# Altium schematic sheet CE842170047_SHEET2.SchDoc
size Tabloid; SheetNumber: 2; SheetTotal: 5; PageSetup: Record=PageOptions|CenterHorizontal=True|CenterVertical=True|PrintScale=0.70|XCorrection=1.00|YCorrection=1.00|PrintKind=1|BorderSize=5000000|LeftOffset=0|BottomOffset=0|Orientation=2|PaperLength=1000|PaperWidth=1000|Scale=100|PaperSource=7|PrintQuality=-4|MediaType=1|DitherType=10|PaperKind=8 1/2x11|PrintScaleMode=1; SPICEModelCacheMIYJXAQF: <root> / <DocumentId>MIYJXAQF</DocumentId> / </root>
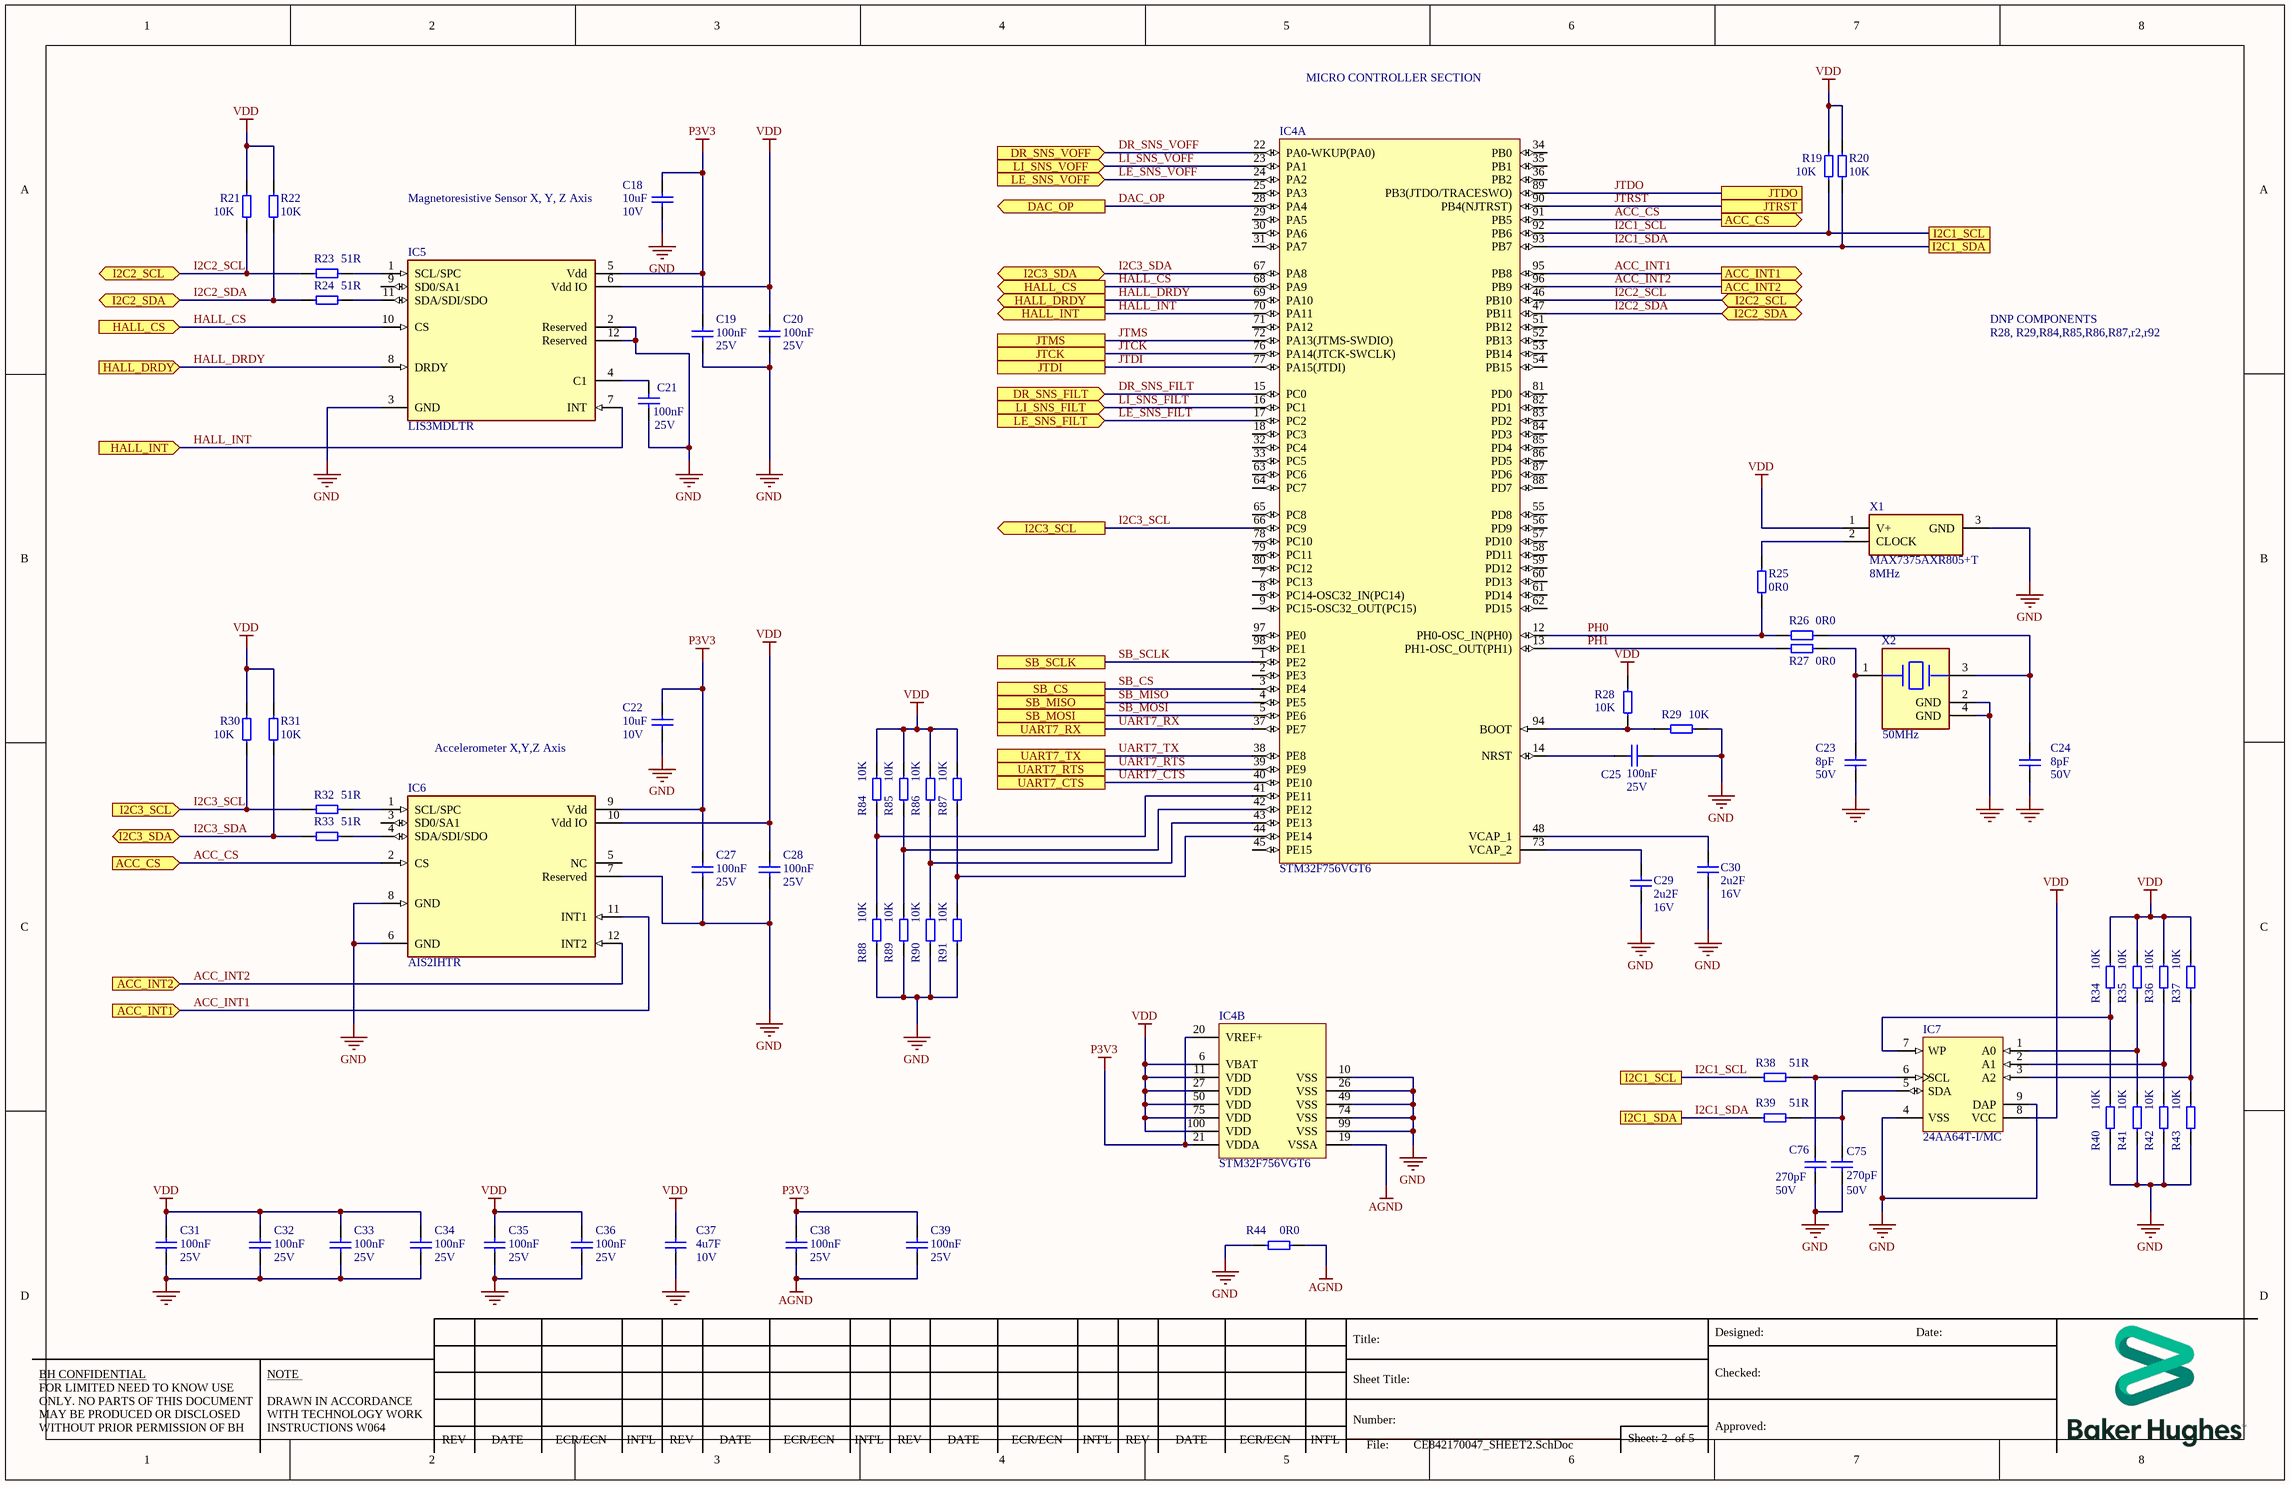
[diagram p0: CE842170047_SHEET2.SchDoc]

## Parts
C18  value 10uF  Voltage: 10V  [C0603]  (hidden comment: KK/96159/3701)
C19  value 100nF  Voltage: 25V  [C0603]  (hidden comment: KK/96159/4501)
C20  value 100nF  Voltage: 25V  [C0603]  (hidden comment: KK/96159/4501)
C21  value 100nF  Voltage: 25V  [C0603]  (hidden comment: KK/96159/4501)
C22  value 10uF  Voltage: 10V  [C0603]  (hidden comment: KK/96159/3701)
C23  value 8pF  Voltage: 50V  [C0603]  (hidden comment: KK/96159/0088)
C24  value 8pF  Voltage: 50V  [C0603]  (hidden comment: KK/96159/0088)
C25  value 100nF  Voltage: 25V  [C0603]  (hidden comment: KK/96159/4501)
C27  value 100nF  Voltage: 25V  [C0603]  (hidden comment: KK/96159/4501)
C28  value 100nF  Voltage: 25V  [C0603]  (hidden comment: KK/96159/4501)
C29  value 2u2F  Voltage: 16V  [C0603]  (hidden comment: KK/96159/3634)
C30  value 2u2F  Voltage: 16V  [C0603]  (hidden comment: KK/96159/3634)
C31  value 100nF  Voltage: 25V  [C0603]  (hidden comment: KK/96159/4501)
C32  value 100nF  Voltage: 25V  [C0603]  (hidden comment: KK/96159/4501)
C33  value 100nF  Voltage: 25V  [C0603]  (hidden comment: KK/96159/4501)
C34  value 100nF  Voltage: 25V  [C0603]  (hidden comment: KK/96159/4501)
C35  value 100nF  Voltage: 25V  [C0603]  (hidden comment: KK/96159/4501)
C36  value 100nF  Voltage: 25V  [C0603]  (hidden comment: KK/96159/4501)
C37  value 4u7F  Voltage: 10V  [C0603]  (hidden comment: KK/96159/2666)
C38  value 100nF  Voltage: 25V  [C0603]  (hidden comment: KK/96159/4501)
C39  value 100nF  Voltage: 25V  [C0603]  (hidden comment: KK/96159/4501)
C75  value 270pF  Voltage: 50V  [C0603]  (hidden comment: KK/96159/0243)
C76  value 270pF  Voltage: 50V  [C0603]  (hidden comment: KK/96159/0243)
IC4  MF_PartNumber: STM32F756VGT6  [LQFP-100]  (hidden comment: KK/95414/0147)  (parts A,B of 2)
IC5  MF_PartNumber: LIS3MDLTR  [LGA-12]  (hidden comment: KK/95312/0195)
IC6  MF_PartNumber: AIS2IHTR  [LGA-12]  (hidden comment: KK/95312/0196)
IC7  MF_PartNumber: 24AA64T-I/MC  [DFN-8]  (hidden comment: KK/95413/0138)
R19  value 10K  [R0603]  (hidden comment: KK/96059/0601)
R20  value 10K  [R0603]  (hidden comment: KK/96059/0601)
R21  value 10K  [R0603]  (hidden comment: KK/96059/0601)
R22  value 10K  [R0603]  (hidden comment: KK/96059/0601)
R23  value 51R  [R0603]  (hidden comment: KK/96059/1369)
R24  value 51R  [R0603]  (hidden comment: KK/96059/1369)
R25  value 0R0  [R0603]  (hidden comment: KK/96059/0000)
R26  value 0R0  [R0603]  (hidden comment: KK/96059/0000)
R27  value 0R0  [R0603]  (hidden comment: KK/96059/0000)
R28  value 10K  [R0603]  (hidden comment: KK/96059/0601)
R29  value 10K  [R0603]  (hidden comment: KK/96059/0601)
R30  value 10K  [R0603]  (hidden comment: KK/96059/0601)
R31  value 10K  [R0603]  (hidden comment: KK/96059/0601)
R32  value 51R  [R0603]  (hidden comment: KK/96059/1369)
R33  value 51R  [R0603]  (hidden comment: KK/96059/1369)
R34  value 10K  [R0603]  (hidden comment: KK/96059/0601)
R35  value 10K  [R0603]  (hidden comment: KK/96059/0601)
R36  value 10K  [R0603]  (hidden comment: KK/96059/0601)
R37  value 10K  [R0603]  (hidden comment: KK/96059/0601)
R38  value 51R  [R0603]  (hidden comment: KK/96059/1369)
R39  value 51R  [R0603]  (hidden comment: KK/96059/1369)
R40  value 10K  [R0603]  (hidden comment: KK/96059/0601)
R41  value 10K  [R0603]  (hidden comment: KK/96059/0601)
R42  value 10K  [R0603]  (hidden comment: KK/96059/0601)
R43  value 10K  [R0603]  (hidden comment: KK/96059/0601)
R44  value 0R0  [R0603]  (hidden comment: KK/96059/0000)
R84  value 10K  [R0603]  (hidden comment: KK/96059/0601)
R85  value 10K  [R0603]  (hidden comment: KK/96059/0601)
R86  value 10K  [R0603]  (hidden comment: KK/96059/0601)
R87  value 10K  [R0603]  (hidden comment: KK/96059/0601)
R88  value 10K  [R0603]  (hidden comment: KK/96059/0601)
R89  value 10K  [R0603]  (hidden comment: KK/96059/0601)
R90  value 10K  [R0603]  (hidden comment: KK/96059/0601)
R91  value 10K  [R0603]  (hidden comment: KK/96059/0601)
X1  value 8MHz  MF_PartNumber: MAX7375AXR805+T  [SC70-3]  (hidden comment: OSCILLATOR_3PIN)
X2  value 50MHz  [SMD_1.6X1.2]  (hidden comment: KK/95710/0071)

## Ports
ACC_CS (in), ACC_CS (out), ACC_INT1 (in), ACC_INT1 (out), ACC_INT2 (in), ACC_INT2 (out), DAC_OP (out), DR_SNS_FILT (in), DR_SNS_VOFF (in), HALL_CS (in), HALL_CS (out), HALL_DRDY (in), HALL_DRDY (out), HALL_INT (in), HALL_INT (out), I2C1_SCL, I2C1_SDA, I2C2_SCL (bidir), I2C2_SDA (bidir), I2C3_SCL (in), I2C3_SCL (out), I2C3_SDA (bidir), JTCK, JTDI, JTDO, JTMS, JTRST, LE_SNS_FILT (in), LE_SNS_VOFF (in), LI_SNS_FILT (in), LI_SNS_VOFF (in), SB_CS, SB_MISO, SB_MOSI, SB_SCLK, UART7_CTS, UART7_RTS, UART7_RX, UART7_TX

## Nets
AGND: C38.2 C39.2 IC4.19(VSSA) R44.2
GND: C18.2 C19.2 C20.2 C21.2 C22.2 C23.2 C24.1 C25.2 C27.2 C28.2 C29.2 C30.2 C31.2 C32.2 C33.2 C34.2 C35.2 C36.2 C37.2 C75.2 C76.2 IC4.10(VSS) IC4.26(VSS) IC4.49(VSS) IC4.74(VSS) IC4.99(VSS) IC5.2(Reserved) IC5.3(GND) IC5.12(Reserved) IC6.6(GND) IC6.7(Reserved) IC6.8(GND) IC7.4(VSS) IC7.9(DAP) R29.1 R40.2 R41.2 R42.2 R43.2 R44.1 R88.2 R89.2 R90.2 R91.2 X1.3(GND) X2.2(GND) X2.4(GND)
P3V3: C18.1 C19.1 C22.1 C27.1 C38.1 C39.1 IC4.20(VREF+) IC4.21(VDDA) IC5.5(Vdd) IC6.9(Vdd)
VDD: C20.1 C28.1 C31.1 C32.1 C33.1 C34.1 C35.1 C36.1 C37.1 IC4.6(VBAT) IC4.11(VDD) IC4.27(VDD) IC4.50(VDD) IC4.75(VDD) IC4.100(VDD) IC5.6(Vdd_IO) IC6.10(Vdd_IO) IC7.8(VCC) R19.2 R20.2 R21.2 R22.2 R28.2 R30.2 R31.2 R34.1 R35.1 R36.1 R37.1 R84.1 R85.1 R86.1 R87.1 X1.1(V+)
ACC_CS: IC4.91(PB5) IC6.2(CS) ; port ACC_CS
ACC_INT1: IC4.95(PB8) IC6.11(INT1) ; port ACC_INT1
ACC_INT2: IC4.96(PB9) IC6.12(INT2) ; port ACC_INT2
DAC_OP: IC4.28(PA4) ; port DAC_OP
DR_SNS_FILT: IC4.15(PC0) ; port DR_SNS_FILT
DR_SNS_VOFF: IC4.22(PA0-WKUP(PA0)) ; port DR_SNS_VOFF
HALL_CS: IC4.68(PA9) IC5.10(CS) ; port HALL_CS
HALL_DRDY: IC4.69(PA10) IC5.8(DRDY) ; port HALL_DRDY
HALL_INT: IC4.70(PA11) IC5.7(INT) ; port HALL_INT
I2C1_SCL: IC4.92(PB6) R19.1 R38.1 ; port I2C1_SCL
I2C1_SDA: IC4.93(PB7) R20.1 R39.1 ; port I2C1_SDA
I2C2_SCL: IC4.46(PB10) R21.1 R23.1 ; port I2C2_SCL
I2C2_SDA: IC4.47(PB11) R22.1 R24.1 ; port I2C2_SDA
I2C3_SCL: IC4.66(PC9) R30.1 R32.1 ; port I2C3_SCL
I2C3_SDA: IC4.67(PA8) R31.1 R33.1 ; port I2C3_SDA
JTCK: IC4.76(PA14(JTCK-SWCLK)) ; port JTCK
JTDI: IC4.77(PA15(JTDI)) ; port JTDI
JTDO: IC4.89(PB3(JTDO/TRACESWO)) ; port JTDO
JTMS: IC4.72(PA13(JTMS-SWDIO)) ; port JTMS
JTRST: IC4.90(PB4(NJTRST)) ; port JTRST
LE_SNS_FILT: IC4.17(PC2) ; port LE_SNS_FILT
LE_SNS_VOFF: IC4.24(PA2) ; port LE_SNS_VOFF
LI_SNS_FILT: IC4.16(PC1) ; port LI_SNS_FILT
LI_SNS_VOFF: IC4.23(PA1) ; port LI_SNS_VOFF
PH0: IC4.12(PH0-OSC_IN(PH0)) R25.2 R26.1
PH1: IC4.13(PH1-OSC_OUT(PH1)) R27.1
SB_CS: IC4.3(PE4) ; port SB_CS
SB_MISO: IC4.4(PE5) ; port SB_MISO
SB_MOSI: IC4.5(PE6) ; port SB_MOSI
SB_SCLK: IC4.1(PE2) ; port SB_SCLK
UART7_CTS: IC4.40(PE10) ; port UART7_CTS
UART7_RTS: IC4.39(PE9) ; port UART7_RTS
UART7_RX: IC4.37(PE7) ; port UART7_RX
UART7_TX: IC4.38(PE8) ; port UART7_TX
NetC21_1: C21.1 IC5.4(C1)
NetC23_1: C23.1 R27.2 X2.1(1_Xtal)
NetC24_2: C24.2 R26.2 X2.3(2_Xtal)
NetC25_1: C25.1 IC4.14(NRST)
NetC29_1: C29.1 IC4.73(VCAP_2)
NetC30_1: C30.1 IC4.48(VCAP_1)
NetC75_1: C75.1 IC7.5(SDA) R39.2
NetC76_1: C76.1 IC7.6(SCL) R38.2
NetIC4_41: IC4.41(PE11) R84.2 R88.1
NetIC4_42: IC4.42(PE12) R85.2 R89.1
NetIC4_43: IC4.43(PE13) R86.2 R90.1
NetIC4_44: IC4.44(PE14) R87.2 R91.1
NetIC4_94: IC4.94(BOOT) R28.1 R29.2
NetIC5_1: IC5.1(SCL/SPC) R23.2
NetIC5_11: IC5.11(SDA/SDI/SDO) R24.2
NetIC6_1: IC6.1(SCL/SPC) R32.2
NetIC6_4: IC6.4(SDA/SDI/SDO) R33.2
NetIC7_1: IC7.1(A0) R35.2 R41.1
NetIC7_2: IC7.2(A1) R36.2 R42.1
NetIC7_3: IC7.3(A2) R37.2 R43.1
NetIC7_7: IC7.7(WP) R34.2 R40.1
NetR25_1: R25.1 X1.2(CLOCK)

Not connected (* = marked no-connect by the designer): IC4 2(PE3) 7(PC13) 8(PC14-OSC32_IN(PC14)) 9(PC15-OSC32_OUT(PC15)) 18(PC3) 25(PA3) 29(PA5) 30(PA6) 31(PA7) 32(PC4) 33(PC5) 34(PB0) 35(PB1) 36(PB2) 45(PE15) 51(PB12) 52(PB13) 53(PB14) 54(PB15) 55(PD8) 56(PD9) 57(PD10) 58(PD11) 59(PD12) 60(PD13) 61(PD14) 62(PD15) 63(PC6) 64(PC7) 65(PC8) 71(PA12) 78(PC10) 79(PC11) 80(PC12) 81(PD0) 82(PD1) 83(PD2) 84(PD3) 85(PD4) 86(PD5) 87(PD6) 88(PD7) 97(PE0) 98(PE1); IC5 9(SD0/SA1); IC6 3(SD0/SA1) 5(NC)

## Notes on the sheet
- MICRO CONTROLLER SECTION
- (near C18) Magnetoresistive Sensor X, Y, Z Axis
- DNP COMPONENTS
- R28, R29,R84,R85,R86,R87,r2,r92
- Accelerometer X,Y,Z Axis
- BH CONFIDENTIAL
- NOTE
- Title:
- Sheet Title:
- Designed:
- Checked:
- Date:
- DRAWN IN ACCORDANCE WITH TECHNOLOGY WORK INSTRUCTIONS W064
- REV
- DATE
- ECR/ECN
- INT'L
- Number:
- Approved:
- FOR LIMITED NEED TO KNOW USE ONLY. NO PARTS OF THIS DOCUMENT MAY BE PRODUCED OR DISCLOSED WITHOUT PRIOR PERMISSION OF BH
- File:
- Sheet:
- of

## Library data of the parts
C18 C22 = KK/96159/3701: CAPACITOR_10uF_10%_10V_0603; ID: 175; Tolerance: 10%; PII_PartNumber: KK/96159/3701; Pins: 2
C19-C21 C25 C27 C28 C31-C36 C38 C39 = KK/96159/4501: CAPACITOR_100nF_+10%_25V_603; ID: 185; Tolerance: 10%; PII_PartNumber: KK/96159/4501; Pins: 2
C23 C24 = KK/96159/0088: CAPACITOR CERAMIC 0603 50V 5% NPO 8pF; ID: 570; PII_PartNumber: KK/96159/0088; Pins: 2; Tolerance: 5%
C29 C30 = KK/96159/3634: CAPACITOR CERAMIC 0603 16V 10% X5R 2u2; ID: 569; PII_PartNumber: KK/96159/3634; Pins: 2; Tolerance: 10%
C37 = KK/96159/2666: CAPACITOR_4u7F_10%_10V_0603; ID: 165; Tolerance: 10%; PII_PartNumber: KK/96159/2666; Pins: 2
C75 C76 = KK/96159/0243: CAPACITOR CER 0603 270pF 10% 50V X5R; ID: 577; PII_PartNumber: KK/96159/0243; Pins: 2; Tolerance: 10%
IC4 = KK/95414/0147: MICROCONTROLLER MCU; Manufacturer: STMICROELECTRONICS; Manufacturer Part Number: STM32F756VGT6U; D/A Converter: 2; I/Os (High Current): 82; Core: ARM Cortex-M7; Packing: Tray; Supply Voltage(Vcc) min (V): 1.7; Operating Frequency(F) (Processor speed) (MHz): 216; Internal RAM Size (kB): 320; FLASH Size (Prog) (kB): 1024; ID: 81; Value: 1MB/32BIT; Voltage: 1.7-3.6V; ComponentLink2Description: Datasheet; DatasheetVersion: Rev. 4; ComponentLink1URL: http://www.st.com/; Package Description: 100-Pin Low Profile Quad Flat Package, Body 14 x 14 mm, Pitch 0.5 mm; ComponentLink1Description: Manufacturer URL; Mounting Technology: Surface Mount; ComponentLink2URL: http://www.st.com/st-web-ui/static/active/en/resource/technical/document/datasheet/DM00166114.pdf; Package Reference: LQFP100; Manufacturer Part Number: STM32F756VGT6; Manufacturer: STMicroelectronics; PII_PartNumber: KK/95414/0147; Pins: 100; Temperature: -40 to +85C
IC5 = KK/95312/0195: 3 AXIS MAGNETIC SENSOR; Manufacturer: STMicroelectronics; Sensor Output: I2C,SPI; Operating Supply Current: 40-270uA; Max Supply Voltage: 3.6V; Min Supply Voltage: 1.71V; ID: 103; Voltage: 1.9 - 3.6V; ComponentLink2URL: https://www.st.com/resource/en/datasheet/lis3mdl.pdf; Category: IC; Manufacturer Part Number: LIS3MDLTR; Octopart: https://octopart.com/lis3mdltr-stmicroelectronics-29403125; Automotive: No; Sensing Method: Magnetic; ComponentLink2Description: Datasheet; RoHS: TRUE; Device Class L3: unset; Device Class L1: Sensors; Temperature: -40 to +85C; Height: 1mm; Mouser Description: Board Mount Hall Effect / Magnetic Sensors Ultra Lo-Pwr Hi Perf 3-Axis 1.9-3.6V; Temperature Range High: +85°C; Lead Free: Yes; Device Class L2: Magnetic Sensors; Footprint Url: https://www.st.com/content/ccc/resource/technical/document/technical_note/73/17/9c/16/dd/96/4a/01/CD00134799.pdf/files/CD00134799.pdf/jcr:content/translations/en.CD00134799.pdf; Temperature Range Low: -40°C; Package: VFLGA-12-8365767; Digikey Description: SENSOR MR I2C/SPI 12LGA; PII_PartNumber: KK/95312/0195; Pins: 12
IC6 = KK/95312/0196: 3 AXIS DIGITAL ACCELEROMETER 14BIT; Manufacturer: STMicroelectronics; Sensor Output: I2C,SPI; Operating Supply Current: 0.67-110uA; Max Supply Voltage: 3.6V; Sensing Method: X,Y,Z; Min Supply Voltage: 1.62V; ID: 102; Voltage: 1.62 - 3.6V; ComponentLink2URL: https://www.st.com/resource/en/datasheet/lis3mdl.pdf; Category: IC; Octopart: https://www.mouser.co.uk/datasheet/2/389/dm00462829-2042226.pdf; Automotive: YES; ComponentLink2Description: Datasheet; RoHS: TRUE; Device Class L3: unset; Device Class L1: Sensors; Temperature: -40 to +115C; Height: 1mm; Mouser Description: Board Mount Hall Effect / Magnetic Sensors Ultra Lo-Pwr Hi Perf 3-Axis 1.9-3.6V; Temperature Range High: +85°C; Lead Free: Yes; Device Class L2: Magnetic Sensors; Footprint Url: https://www.st.com/content/ccc/resource/technical/document/technical_note/73/17/9c/16/dd/96/4a/01/CD00134799.pdf/files/CD00134799.pdf/jcr:content/translations/en.CD00134799.pdf; Temperature Range Low: -40°C; Package: VFLGA-12-8365767; Digikey Description: SENSOR MR I2C/SPI 12LGA; PII_PartNumber: KK/95312/0196; Pins: 12
IC7 = KK/95413/0138: 64K I2C SERIAL EEPROM; Manufacturer: MICROCHIP; ID: 43; DatasheetVersion: revQ, Jun-2009; PackageReference: DFN-MC8; PackageDescription: 8-Lead Plastic Dual Flat, No Lead Package (MC) - 2x3x0.9mm Body [DFN]; PackageVersion: revBB, Aug-2009; Manufacturer Part Number: 24AA64T-I/MC; PII_PartNumber: KK/95413/0138; Pins: 9; Temperature: -40 +85C
R19-R22 R28-R31 R34-R37 R40-R43 R84-R91 = KK/96059/0601: RESISTOR_10K_1%_0603J_63mW; ID: 1090; Tolerance: 1%; Power: 63mW; PII_PartNumber: KK/96059/0601; Pins: 2
R23 R24 R32 R33 R38 R39 = KK/96059/1369: RESISTOR_51R_1%_0603J_63mW; ID: 1148; Tolerance: 1%; Power: 63mW; Temp_Coeff: 100ppm; PII_PartNumber: KK/96059/1369; Pins: 2
R25-R27 R44 = KK/96059/0000: ZERO OHM LINK; ID: 7; Power: 63mW; PII_PartNumber: KK/96059/0000; Pins: 2
X1 = KK/95710/0303: OSCILLATOR,SMD,CMOS,MAXIM,MAX7375AXR805+T; ID: 62; Voltage: 2.7-5.5V; Temp_Coeff: 50PPM; PII_PartNumber: KK/95710/0303; Pins: 3; Temperature: -40 +125C; Manufacturer: MAXIM
X2 = KK/95710/0071: CRYSTAL SMD 50MHz 8pF; Manufacturer: NDK; Manufacturer Part Number: NX1612SA-50M-EXS00A-CS08403; ESR (Equivalent Series Resistance): 80R; Frequency Stability: 15ppm; Frequency Tolerance: 10ppm; ID: 61; Case/Package: SMD/SMT; Min Operating Temperature: -30°C; Packaging: Cut Tape; Max Operating Temperature: 85°C; Mount: Surface Mount; Load Capacitance: 8pF; MF_PartNumber: NX1612SA-50M-EXS00A-CS08403; PII_PartNumber: KK/95710/0071; Pins: 4; Voltage: 8pF; Temperature: -30 to +85C